# EAGLE design controllerboost (EAGLE 7.7.0)
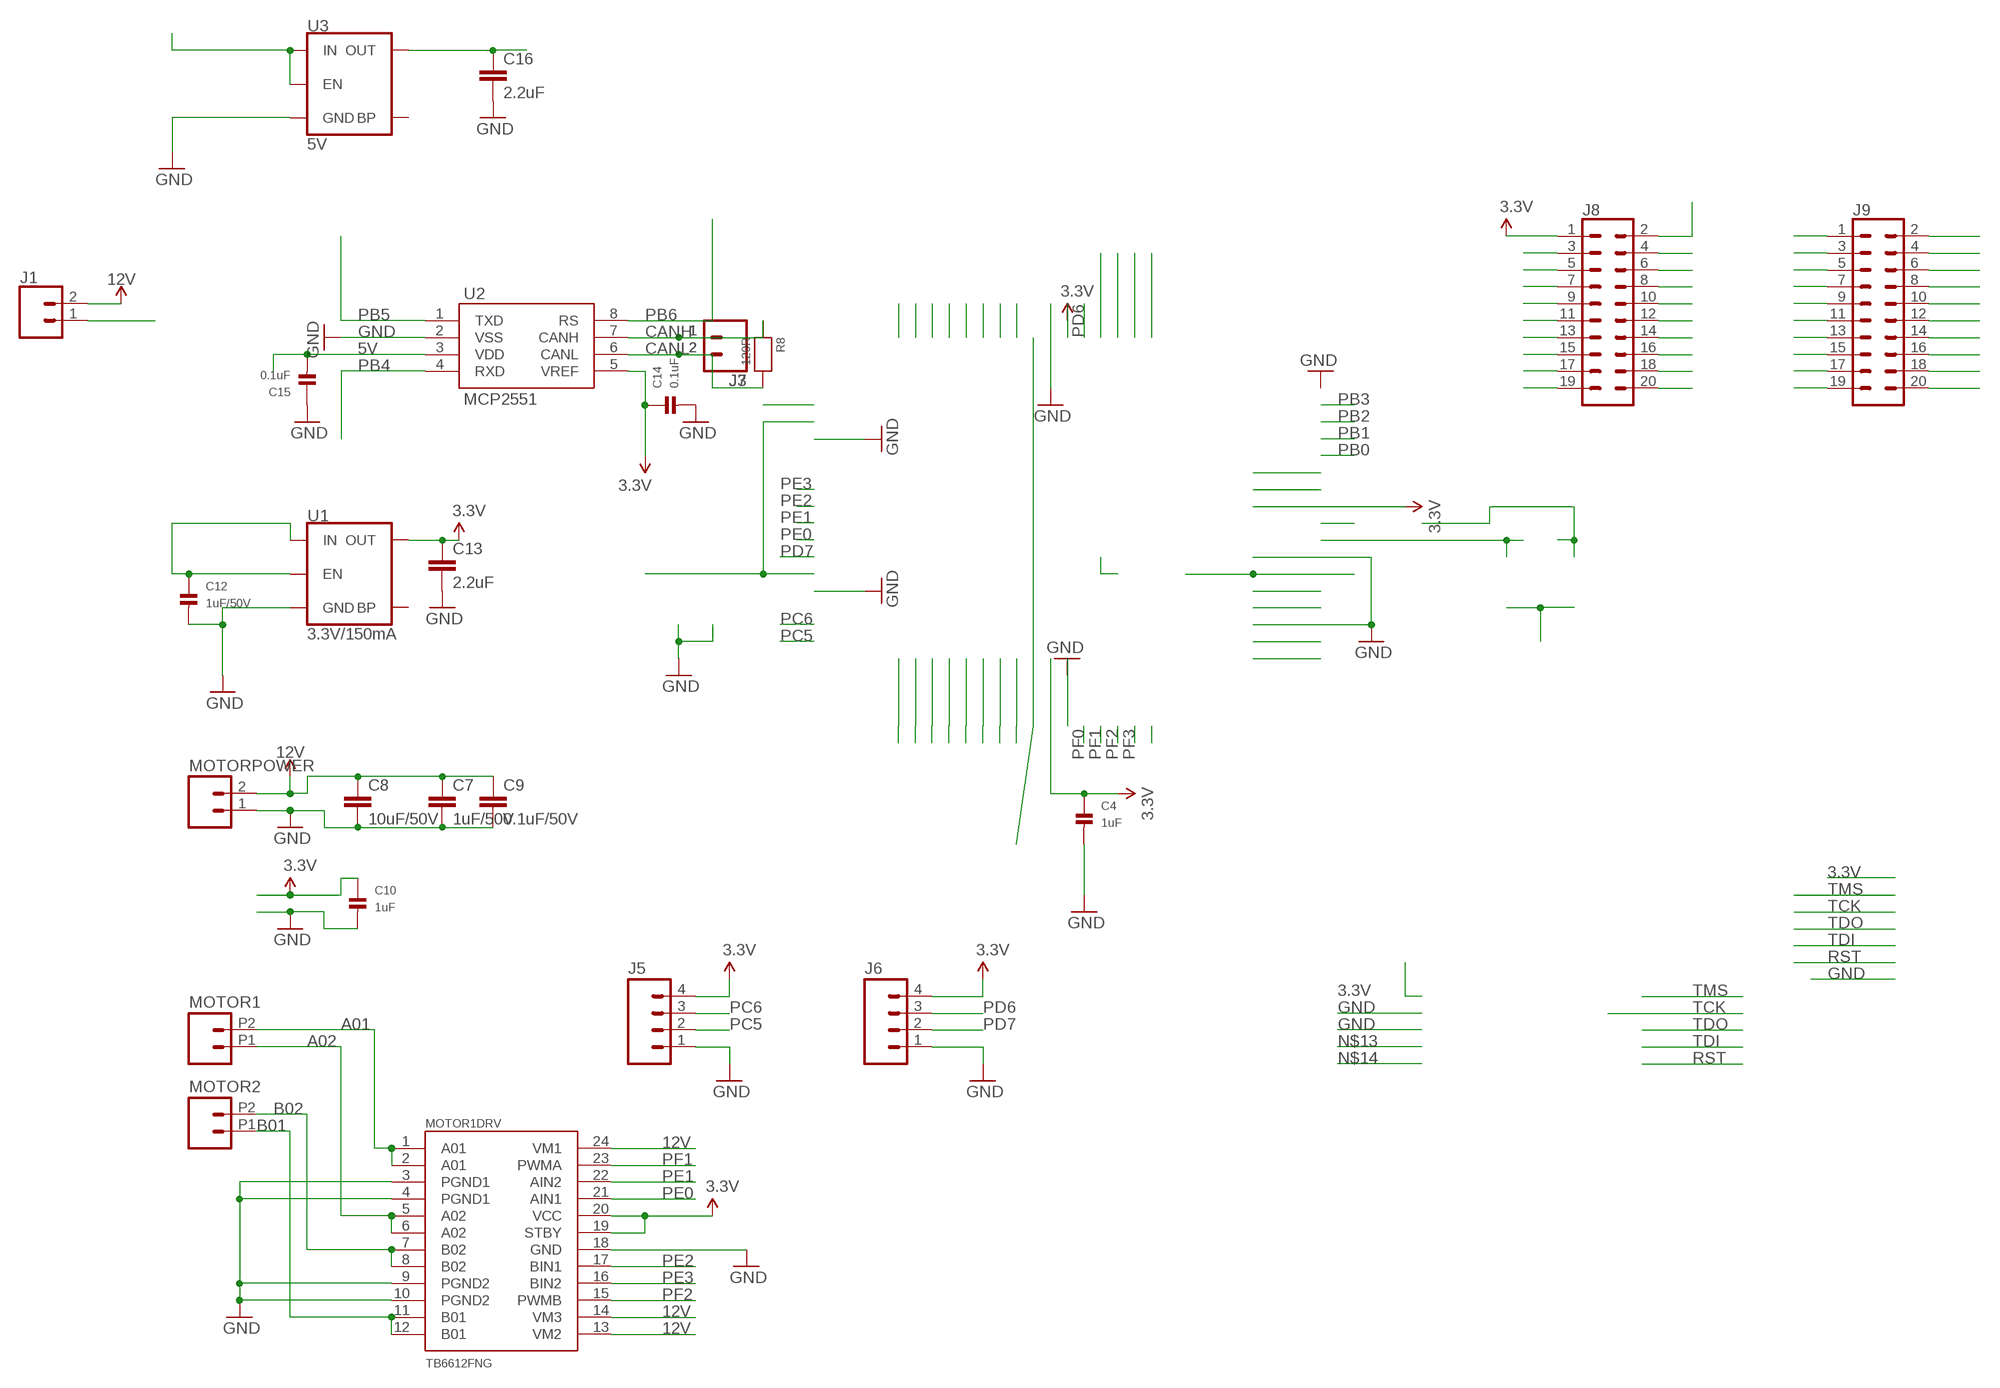
[diagram p0: schematic, sheet 1]

## Parts
C4  1uF  CAP_CERAMIC_0603MP  [_0603MP]
C7  1uF/50V  0.1UF-25V(+80/-20%)(0603)  [0603-CAP]
C8  10uF/50V  1.0UF-25V-+80/-20(0805)"  [0805-CAP]
C9  0.1uF/50V  0.1UF-25V(+80/-20%)(0603)  [0603-CAP]
C10  1uF  CAP_CERAMIC_0603MP  [_0603MP]
C12  1uF/50V  CAP_CERAMIC_0603MP  [_0603MP]
C13  2.2uF  2.2UF-0805-25V-(+80/-20%)  [0805]
C14  0.1uF  CAP_CERAMIC_0603MP  [_0603MP]
C15  0.1uF  CAP_CERAMIC_0603MP  [_0603MP]
C16  2.2uF  2.2UF-0805-25V-(+80/-20%)  [0805]
J1  CONN_02  [1X02]
J3  CONN_02  [1X02]
J5  M04PTH  [1X04]
J6  M04PTH  [1X04]
J7  CONN_02  [1X02]
J8  CONN_10X2  [2X10]
J9  CONN_10X2  [2X10]
MOTOR1  M022.54MM_SCREWTERM  [1X02_2.54_SCREWTERM@1]
MOTOR1DRV  TB6612FNG  [SSOP24]
MOTOR2  M022.54MM_SCREWTERM  [1X02_2.54_SCREWTERM@1]
MOTORPOWER  M02PTH  [1X02@1]
R8  120R  RESISTOR_0603MP  [_0603MP]
U1  3.3V/150mA  V_REG_MIC52053.3V  [SOT23-5]
U2  MCP2551  [SO08]
U3  5V  V_REG_MIC52053.3V  [SOT23-5]

## Nets
3.3V: C4.1 C10.1 C13.1 C14.1 J5.4 J6.4 J8.1 MOTOR1DRV.19(STBY) MOTOR1DRV.20(VCC) U1.5(OUT) U2.5(VREF)
5V: C15.2 C16.1 J8.2 U2.3(VDD) U3.5(OUT)
12V: C7.1 C8.1 C9.1 J1.2 MOTOR1DRV.13(VM2) MOTOR1DRV.14(VM3) MOTOR1DRV.24(VM1) MOTORPOWER.2
A01: MOTOR1.P2 MOTOR1DRV.1(A01) MOTOR1DRV.2(A01)
A02: MOTOR1.P1 MOTOR1DRV.5(A02) MOTOR1DRV.6(A02)
B01: MOTOR1DRV.11(B01) MOTOR1DRV.12(B01) MOTOR2.P1
B02: MOTOR1DRV.7(B02) MOTOR1DRV.8(B02) MOTOR2.P2
CANH: J3.1 J7.1 R8.1 U2.7(CANH)
CANL: J3.2 J7.2 R8.2 U2.6(CANL)
GND: C4.2 C7.2 C8.2 C9.2 C10.2 C12.2 C13.2 C14.2 C15.1 C16.2 J5.1 J6.1 J8.4 J9.2 MOTOR1DRV.3(PGND1) MOTOR1DRV.4(PGND1) MOTOR1DRV.9(PGND2) MOTOR1DRV.10(PGND2) MOTOR1DRV.18(GND) MOTORPOWER.1 U1.2(GND) U2.2(VSS) U3.2(GND)
P2L: C12.1 J1.1 U1.1(IN) U1.3(EN) U3.1(IN) U3.3(EN)
PA2: J9.20
PA3: J9.18
PA4: J9.16
PA5: J8.15
PA6: J8.17
PA7: J8.19
PB0: J8.5
PB1: J8.7
PB2: J9.4
PB3: J9.5
PB4: J8.13 U2.4(RXD)
PB5: J8.3 U2.1(TXD)
PB6: J9.14 U2.8(RS)
PB7: J9.12
PC4: J9.7
PC5: J5.2 J9.9
PC6: J5.3 J9.11
PC7: J9.13
PD0: J8.6
PD1: J8.8
PD2: J8.10
PD3: J8.12
PD6: J6.3 J9.15
PD7: J6.2 J9.17
PE0: J9.6 MOTOR1DRV.21(AIN1)
PE1: J8.14 MOTOR1DRV.22(AIN2)
PE2: J8.16 MOTOR1DRV.17(BIN1)
PE3: J8.18 MOTOR1DRV.16(BIN2)
PE4: J8.9
PE5: J8.11
PF0: J9.8
PF1: J8.20 MOTOR1DRV.23(PWMA)
PF2: J9.1 MOTOR1DRV.15(PWMB)
PF3: J9.3
PF4: J9.19
RST: J9.10
Unconnected: U1.4(BP) U3.4(BP)

## Library data of the parts
C4 C10 C12 C14 C15 = microbuilder:CAP_CERAMIC: Ceramic Capacitors 0402 - 0402 Surface Mount Capacitors 16pF 50V 5% [Digikey: 445-4899-2-ND] 18pF 50V 5% [Digikey: 490-1281-2-ND] 22pF 50V 5% [Digikey: 490-1283-2-ND] 68pF 50V 5% [Digikey: 490-1289-2-ND] 0.1uF 10V 10% [Digikey: 490-1318-2-ND] 1.0uF 6.3V 10% [Digikey: 490-1320-2-ND] 0603 - 0603 Surface Mount Capacitors 16 pF 50V 5% [Digikey: 445-5051-2-ND] 22 pF 50V [Digikey: PCC220ACVTR-ND] 33 pF 50V 5% [Digikey: 490-1415-1-ND] 56pF 50V 5% [Digikey: 490-1421-1-ND] 220pF 50V 5% [Digikey: 445-1285-1-ND] 680 pF 50V 2200 pF 50V 5% C0G [Digikey: 445-1297-1-ND] 5600 pF 100V 5% X7R [Digikey: 478-3711-1-ND] 0.1 µF 25V 10% [Digikey: PCC2277TR-ND] 0.22 µF 16V 10% X7R [Digikey: 445-1318-1-ND] 1.0 µF 25V 10% [Digikey: 445-5146-2-ND] 0603 - RF Specific 3pF 250V +/-0.1pF RF [Digikey: 712-1347-1-ND] 18 pF 250V 5% [Digikey: 478-3505-1-ND or 712-1322-1-ND] 56 pF 250V 5% C0G RF [Digikey: 490-4867-1-ND] 68 pF 250V RF [Digikey: 490-4868-1-ND] 0805 - 0805 Surface Mount Capacitors 220 pF 250V 2% RF Ceramic Capacitor [Digikey: 712-1398-1-ND] 1000 pF 50V 2% NP0 Ceramic Capacitor [Digikey: 478-3760-1-ND] 0.1 µF 25V 10% Ceramic Capacitor [Digikey: PCC1828TR-ND] 1.0 µF 16V 10% Ceramic Capacitor[Digikey: 490-1691-2-ND] 10.0 µF 10V 10% Ceramic Capacitor[Digikey: 709-1228-1-ND] 10.0 uF 16V 10% Ceramic Capacitor [Digikey: 478-5165-2-ND] 47 uF 6.3V 20% Ceramic Capacitor [Digikey: 587-1779-1-ND or 399-5506-1-ND] 1206 - 1206 Surface Mount Capacitors 47uF 10V 20% Ceramic Capacitor [Digikey: 490-5528-1-ND or 399-5508-1-ND or 445-6010-1-ND] 100uF 6.3V -20%, +80% Y5V Ceramic Capacitor (Digikey: 490-4512-1-ND, Mouser: 81-GRM31CF50J107ZE1L)
C7 C9 = SparkFun-Capacitors:0.1UF-25V(+80/-20%)(0603): CAP-00810 Ceramic Standard decoupling cap; PROD_ID: CAP-00810; VALUE: 0.1uF
C8 = SparkFun-Capacitors:1.0UF-25V-+80/-20(0805): CAP-11625; PROD_ID: CAP-11625; VALUE: 1.0uF
C13 C16 = SparkFun-Capacitors:2.2UF: 2.2µF ceramic capacitors A capacitor is a passive two-terminal electrical component used to store electrical energy temporarily in an electric field.; PROD_ID: CAP-11624
J1 J3 J7 = SparkFun-Connectors:CONN_02: Multi connection point. Often used as Generic Header-pin footprint for 0.1 inch spaced/style header connections On any of the 0.1 inch spaced packages, you can populate with these: Break Away Headers - Straight <https://www.sparkfun.com/products/116> (PRT-00116) Break Away Male Headers - Right Angle <https://www.sparkfun.com/products/553> (PRT-00553) Female Headers <https://www.sparkfun.com/products/115> (PRT-00115) Break Away Headers - Machine Pin <https://www.sparkfun.com/products/117> (PRT-00117) Break Away Female Headers - Swiss Machine Pin <https://www.sparkfun.com/products/743> (PRT-00743) For SCREWTERMINALS and SPRING TERMINALS visit here: Screw Terimnals on SparkFun.com <https://www.sparkfun.com/search/results?term=Screw+Terminals> (5mm/3.5mm/2.54mm spacing) This device is also useful as a general connection point to wire up your design to another part of your project. Our various solder wires solder well into these plated through hole pads. Hook-Up Wire - Assortment (Stranded, 22 AWG) <https://www.sparkfun.com/products/11375> (PRT-11375) Hook-Up Wire - Assortment (Solid Core, 22 AWG) <https://www.sparkfun.com/products/11367> (PRT-11367) View the entire wire category on our website here <https://www.sparkfun.com/categories/141> Special notes: Molex polarized connector foot print use with: PRT-08233 with associated crimp pins and housings. 2.54_SCREWTERM for use with PRT-10571. 3.5mm Screw Terminal footprints for PRT-08084 5mm Screw Terminal footprints for use with PRT-08432
J5 J6 = SparkFun-Connectors:M04: Header 4 Standard 4-pin 0.1" header. Use with straight break away headers (SKU : PRT-00116), right angle break away headers (PRT-00553), swiss pins (PRT-00743), machine pins (PRT-00117), and female headers (PRT-00115). Molex polarized connector foot print use with SKU : PRT-08231 with associated crimp pins and housings. 1MM SMD Version SKU: PRT-10208; PROD_ID: CONN-09696
J8 J9 = SparkFun-Connectors:CONN_10X2: Multi connection point. Often used as Generic Header-pin footprint for 0.1 inch spaced/style header connections On any of the 0.1 inch spaced packages, you can populate with these: Break Away Headers - Straight <https://www.sparkfun.com/products/116> (PRT-00116) Break Away Male Headers - Right Angle <https://www.sparkfun.com/products/553> (PRT-00553) Female Headers <https://www.sparkfun.com/products/115> (PRT-00115) Break Away Headers - Machine Pin <https://www.sparkfun.com/products/117> (PRT-00117) Break Away Female Headers - Swiss Machine Pin <https://www.sparkfun.com/products/743> (PRT-00743) Special note about the "SPECIAL" package: This was SPECIALLY designed to be used with our Graphic LCD Backpack. Be sure you want to use this! It is not only staggered on each line of header holes, but IT IS ALSO offset of the center point of the top and bottom lines by 5 mil. This causes the headers to lock into place on the "standard" footprint on the LCD screen. The extra squares on the tdocu layer are there simply to reference other pins (if you were to actually populate a longer header than ten long - this is what we do with the backpacks).
MOTOR1 MOTOR2 MOTORPOWER = SparkFun-Connectors:M02: Standard 2-pin 0.1" header. Use with - straight break away headers ( PRT-00116) - right angle break away headers (PRT-00553) - swiss pins (PRT-00743) - machine pins (PRT-00117) - female headers (PRT-00115) Molex polarized connector foot print use with: PRT-08233 with associated crimp pins and housings. 2.54_SCREWTERM for use with PRT-10571. 3.5mm Screw Terminal footprints for PRT-08084 5mm Screw Terminal footprints for use with PRT-08432
MOTOR1DRV = SparkFun-IC-Special-Function:TB6612FNG: Toshiba 1A dual motor driver IC-09363; PROD_ID: IC-09363
R8 = microbuilder:RESISTOR: Resistors 0402 - 0402 Surface Mount Package 22 Ohm 1% 1/16W [Digikey: 311-22.0LRTR-ND] 33 Ohm 5% 1/16W 1.0K 5% 1/16W 1.5K 5% 1/16W 2.0K 1% 1/16W 10.0K 1% 1/16W [Digikey: 311-10.0KLRTR-ND] 10.0K 5% 1/16W [Digikey: RMCF0402JT10K0TR-ND] 12.1K 1% 1/16W [Digikey: 311-22.0LRTR-ND] 100.0K 5% 1/16W 0603 - 0603 Surface Mount Package 0 Ohm 1/10 Watt 1% Resistor 15 Ohm 1/10 Watt 1% Resistor 33 Ohm 1/10 Watt 1% Resistor 49.9 Ohm 1/10 Watt 1% Resistor 100 Ohm 1/10 Watt 1% Resistor 150 Ohm 1/10 Watt 1% Resistor 240 Ohm 1/10 Watt 1% Resistor 390 Ohm 1/10 Watt 1% Resistor 560 Ohm 1/10 Watt 1% Resistor 680 Ohm 1/10 Watt 1% Resistor 750 Ohm 1/10 Watt 1% Resistor 1.0K Ohm 1/10 Watt 1% Resistor 1.5K Ohm 1/10 Watt 1% Resistor 2.0K Ohm 1/10 Watt 1% Resistor 2.2K Ohm 1/10 Watt 1% Resistor 3.3K Ohm 1/10 Watt 1% Resistor 4.7K Ohm 1/10 Watt 1% Resistor 10.0K Ohm 1/10 Watt 1% Resistor 12.0K Ohm 1/10 Watt 1% Resistor 12.1K Ohm 1/10 Watt 1% Resistor 20.0K Ohm 1/10 Watt 1% Resistor 33.0K Ohm 1/10 Watt 1% Resistor 100.0K Ohm 1/10 Watt 1% Resistor 0805 - 0805 Surface Mount Package 0 Ohm 1/8 Watt 1% Resistor 33 Ohm 1/8 Watt 1% Resistor 100 Ohm 1/8 Watt 1% Resistor 150 Ohm 1/8 Watt 1% Resistor 200 Ohm 1/8 Watt 1% Resistor 240 Ohm 1/8 Watt 1% Resistor 330 Ohm 1/8 Watt 1% Resistor 390 Ohm 1/8 Watt 1% Resistor 470 Ohm 1/8 Watt 1% Resistor 1.0K Ohm 1/8 Watt 1% Resistor 1.5K Ohm 1/8 Watt 1% Resistor 2.0K Ohm 1/8 Watt 1% Resistor 4.7K Ohm 1/8 Watt 1% Resistor 5.1K Ohm 1/8 Watt 1% Resistor 5.6K Ohm 1/8 Watt 1% Resistor 10.0K Ohm 1/8 Watt 1% Resistor 22.0K Ohm 1/8 Watt 1% Resistor 33.0K Ohm 1/8 Watt 1% Resistor 100K Ohm 1/8 Watt 1% Resistor 1206 - 1206 Surface Mount Package 2012 - 2010 Surface Mount Package 0.11 Ohm 1/2 Watt 1% Resistor - Digikey: RHM.11UCT-ND
U1 = SparkFun-IC-Power:V_REG_MIC5205: V_REG MIC5205 Standard 3.3V, 5V, and Adjustable 150mA LDO voltage regulator in SOT-23 layout. Micrel part MIC5205. BP (by-pass) pin is used to lower output noise with 470pF cap, may be left open. On the adjustable version BP is used to set output.; PROD_ID: VREG-00822
U2 = SparkFun-IC-Comms:MCP2551: MCP2551 High Speed CAN Transceiver High speed CAN transceiver Datasheet <http://www.sparkfun.com/datasheets/DevTools/Arduino/MCP2551.pdf> SparkFun Products CAN-BUS Shield <https://www.sparkfun.com/products/13262> (DEV-13262) SparkFun OBD-II UART <https://www.sparkfun.com/products/9555> (WIG-09555); PROD_ID: IC-09907
U3 = SparkFun-IC-Power:V_REG_MIC5205: V_REG MIC5205 Standard 3.3V, 5V, and Adjustable 150mA LDO voltage regulator in SOT-23 layout. Micrel part MIC5205. BP (by-pass) pin is used to lower output noise with 470pF cap, may be left open. On the adjustable version BP is used to set output.; PROD_ID: VREG-00822; VALUE: 3.3V/150mA

## Board
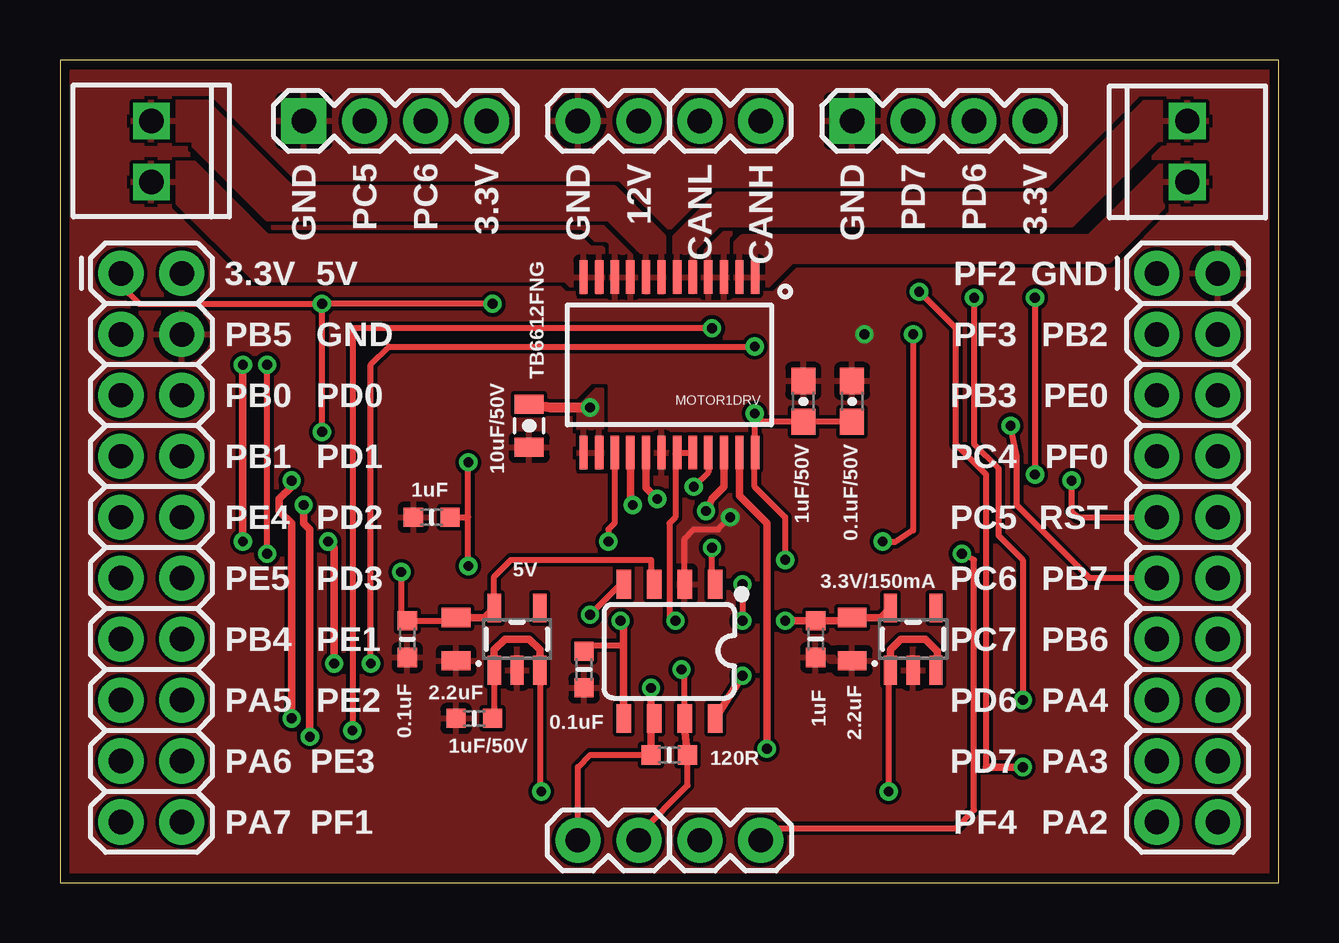
[diagram p1: board, top side]
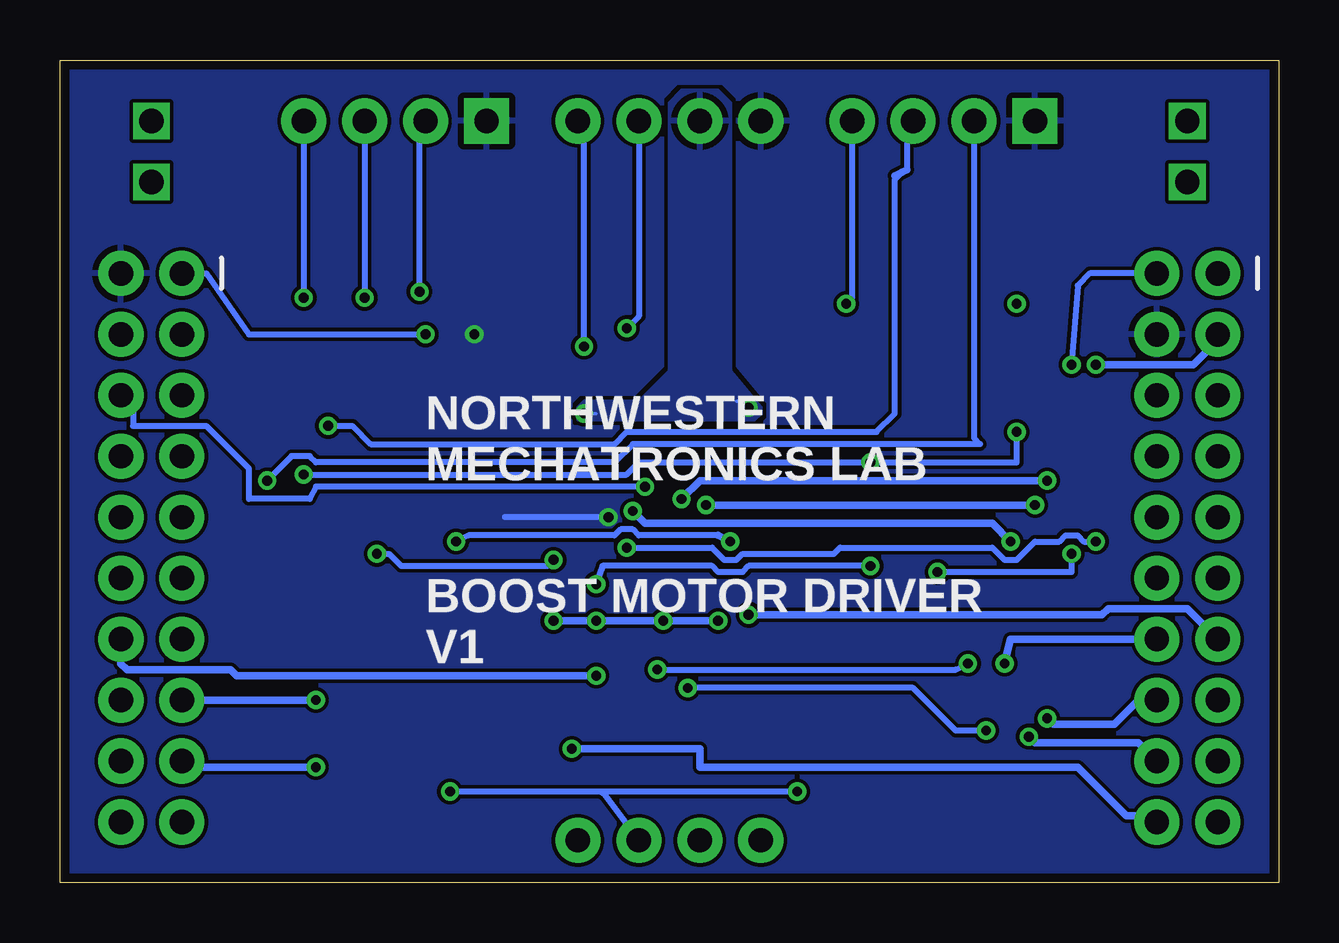
[diagram p2: board, bottom side, seen from below]

Size 50.8 x 34.29 mm. Coordinates in mm from the lower left corner, seen from the top.
Outline: 0,0 50.8,0 50.8,34.29 0,34.29 0,0
Copper layers (1*16): Top 0.0356mm / dielectric 1.5011mm / Bottom 0.0356mm
Design rules "LaenPCBOrder *": minimum track width 6mil, minimum drill 13mil, track to track 6mil, track to pad 6mil, pad to pad 6mil, via to via 6mil, smd to smd 6mil, copper to edge 15mil, drill to drill 6mil, minimum pad ring 7mil, minimum via ring 7mil, stop-mask expansion 3mil, vias tented up to drill 30mil, thermal gap 10mil

### Footprints (pad centres in the part's own frame; a part is rotated, then mirrored left to right if it is on the bottom)
_0603MP = smd 0.8 x 0.8: 1 -0.762,0; 2 0.762,0
0603-CAP = smd 1.1 x 1: 1 -0.85,0; 2 0.85,0
0805-CAP = smd 0.8 x 1.2: 1 -0.9,0; 2 0.9,0
0805 = smd 0.8 x 1.2: 1 -0.9,0; 2 0.9,0
1X02 = drill 1.016 pad 1.88: 1 0,0; 2 2.54,0
1X04 = drill 1.016 pad 1.88 square: 1 0,0 | drill 1.016 pad 1.88: 2 2.54,0; 3 5.08,0; 4 7.62,0
2X10 = drill 1.016 pad 1.88: 1 0,0; 2 0,2.54; 3 2.54,0; 4 2.54,2.54; 5 5.08,0; 6 5.08,2.54; 7 7.62,0; 8 7.62,2.54; 9 10.16,0; 10 10.16,2.54; 11 12.7,0; 12 12.7,2.54; 13 15.24,0; 14 15.24,2.54; 15 17.78,0; 16 17.78,2.54; 17 20.32,0; 18 20.32,2.54; 19 22.86,0; 20 22.86,2.54
1X02_2.54_SCREWTERM@1 = drill 1.016 square: P1 2.54,0; P2 0,0
SSOP24 = smd 0.348 x 1.397: 1 -3.575,-3.656; 2 -2.925,-3.656; 3 -2.275,-3.656; 4 -1.625,-3.656; 5 -0.975,-3.656; 6 -0.325,-3.656; 7 0.325,-3.656; 8 0.975,-3.656; 9 1.625,-3.656; 10 2.275,-3.656; 11 2.925,-3.656; 12 3.575,-3.656; 13 3.575,3.656; 14 2.925,3.656; 15 2.275,3.656; 16 1.625,3.656; 17 0.975,3.656; 18 0.325,3.656; 19 -0.325,3.656; 20 -0.975,3.656; 21 -1.625,3.656; 22 -2.275,3.656; 23 -2.925,3.656; 24 -3.575,3.656
1X02@1 = drill 1.016 pad 1.88: 1 0,0; 2 2.54,0
SOT23-5 = smd 0.55 x 1.2: 1 -0.95,-1.3; 2 0,-1.3; 3 0.95,-1.3; 4 0.95,1.3; 5 -0.95,1.3
SO08 = smd 0.6 x 1.2: 1 -1.905,-2.8; 2 -0.635,-2.8; 3 0.635,-2.8; 4 1.905,-2.8; 5 1.905,2.8; 6 0.635,2.8; 7 -0.635,2.8; 8 -1.905,2.8

### Placement (x,y rotation side)
C4  31.5,10.16 270 top
C7  30.99,20.07 90 top
C8  19.56,19.05 270 top
C9  33.02,20.07 90 top
C10  15.49,15.24 180 top
C12  17.27,6.86 180 top
C13  33.02,10.16 270 top
C14  21.84,8.89 270 top
C15  14.48,10.16 90 top
C16  16.51,10.16 270 top
J1  26.67,1.78 0 top
J3  24.13,1.78 180 top
J5  10.16,31.75 0 top
J6  33.02,31.75 0 top
J7  29.21,31.75 180 top
J8  2.54,25.4 270 top
J9  45.72,25.4 270 top
MOTOR1  46.99,29.21 90 top
MOTOR1DRV  25.4,21.59 180 top
MOTOR2  3.81,31.75 270 top
MOTORPOWER  21.59,31.75 0 top
R8  25.4,5.33 180 top
U1  35.56,10.16 0 top
U2  25.4,9.65 180 top
U3  19.05,10.16 0 top

### Tracks (layer width: path | path; a pad name or v marks a point on that pad's centre or on a via)
3.3V  (via drill 0.41)
  Top 0.254: J8.1 2.54,24.89 3.3,24.13 v10.92,24.13 | C14.1 22.1,9.91 23.5,9.91 | MOTOR1DRV.20 MOTOR1DRV.19 25.65,17.86 25.65,15.24 25.4,14.99 25.4,10.92 v25.65,10.92 | v40.64,24.38 v40.64,17.02 | v10.92,18.8 v10.92,24.13 | v17.02,13.21 17.02,15.24 | 17.02,15.24 v17.02,17.53 | v28.45,12.45 v28.45,10.92 | v18.03,24.13 v10.92,24.13 | C10.1 17.02,15.24
  Top 0.305: U1.5 34.21,11.06 C13.1 32.88,10.92 C4.1 v30.23,10.92 | U2.5 23.5,9.91 23.5,10.79 v23.37,10.92
  Bottom 0.254: J6.4 v40.64,24.38 | v40.64,17.02 27.18,17.02 26.67,17.53 v17.02,17.53 10.92,17.53 v10.92,18.8 | v17.02,13.21 22.1,13.21 22.35,12.95 23.37,12.95 23.62,13.21 28.19,13.21 v28.45,12.45 | J5.4 17.78,24.38 v18.03,24.13
  Bottom 0.305: v23.37,10.92 v25.65,10.92 v28.45,10.92 v30.23,10.92
5V  (via drill 0.41)
  Top 0.254: C16.1 16.37,10.92 C15.2 14.22,11.18 v14.22,12.95 | U3.5 18.1,12.77 18.8,13.46 24.64,13.46 24.64,12.58 U2.3 | v8.64,13.72 v8.64,21.59
  Top 0.305: C16.1 17.7,11.06 U3.5
  Bottom 0.254: J8.2 7.87,25.4 8.38,24.89 v8.64,21.59 | v8.64,13.72 8.64,12.95 v14.22,12.95
12V  (via drill 0.41)
  Top 0.152: MOTOR1DRV.24 28.96,17.95
  Top 0.254: v37.59,13.72 38.1,13.46 38.1,3.05 37.34,2.29 29.46,2.29 J1.2 | C9.1 C7.1 29.3,19.22 v28.96,19.56 28.98,19.54 MOTOR1DRV.24 28.96,17.91 28.96,16.51 30.23,15.24 v30.23,13.46
  Top 0.406: C8.1 20.46,19.81 v22.1,19.81
  Bottom 0.152: v28.96,19.56 28.45,19.56 | v22.1,19.81 22.35,20.07 22.61,20.07
  Bottom 0.254: v37.59,13.72 37.08,13.72 36.58,13.21 30.48,13.21 v30.23,13.46
  pour Bottom: 23.37,33.02 24.89,33.02 25.4,32.51 25.4,21.34 26.67,20.07 28.96,20.07 29.21,19.81 29.21,19.3 21.84,19.3 21.59,19.56 21.59,19.81 22.86,21.34 22.86,32.51
  pour Top: 21.59,17.53 21.59,19.81 21.84,20.07 22.35,20.57 22.61,20.57 22.61,17.27 21.59,17.27
A01
  pour Top: 28.19,24.64 28.19,26.67 28.45,26.92 42.93,26.92 45.97,29.97 47.75,29.97 47.75,28.45 46.23,28.45 43.69,25.91 30.48,25.91 29.21,24.64 28.45,24.64
A02
  pour Top: 25.65,24.64 25.65,26.92 27.43,28.7 41.4,28.7 45.21,32.51 47.75,32.51 47.75,30.99 45.72,30.99 42.16,27.43 27.43,27.43 26.42,26.42 26.42,24.64
B01
  pour Top (isolate 0.152): 3.3,28.45 4.83,28.45 8.13,25.15 21.08,25.15 21.59,24.64 22.61,24.64 22.61,26.42 22.1,26.42 21.59,26.92 8.64,26.92 5.59,29.97 3.05,29.97 3.05,28.45
B02
  pour Top (isolate 0.152): 3.05,30.99 5.59,30.99 5.59,30.73 8.64,27.69 22.86,27.69 24.13,26.42 24.38,26.16 24.38,24.64 25.15,24.64 25.15,26.92 23.11,28.96 9.65,28.96 6.1,32.51 3.05,32.51
CANH  (via drill 0.41)
  Top 0.254: U2.7 26.04,8.76 v25.91,8.89 | v12.95,9.14 12.95,21.59 13.72,22.35 v28.96,22.35 | J3.1 24.13,2.03 26.16,4.06 R8.1
  Top 0.305: U2.7 26.04,6.48 R8.1
  Bottom 0.254: v25.91,8.89 13.46,8.89 v12.95,9.14 | v28.96,22.35 28.96,31.5 J7.1
CANL  (via drill 0.41)
  Top 0.254: v27.18,23.11 12.19,23.11 v12.19,6.35 | v24.64,8.13 24.64,6.98 U2.6 | J3.2 21.59,4.83 22.1,5.33 R8.2
  Top 0.305: R8.2 v24.64,8.13
  Bottom 0.254: J7.2 26.67,23.62 v27.18,23.11 | v12.19,6.35 13.46,6.35 15.24,8.13 v24.64,8.13
GND  (via drill 0.41)
  Top 0.254: U2.2 26.04,14.35 26.42,14.73 27.43,14.73 v27.94,15.24
  Bottom 0.254: v27.94,15.24 32.26,15.24
  other vias: 33.53,22.86
  pour Bottom (rank 6): -1.27,36.83 52.32,36.83 52.32,-2.29 -1.27,-2.29
  pour Top (rank 6): 0,36.58 52.32,36.58 52.32,-2.29 -1.27,-2.29 -1.27,36.58
P2L  (via drill 0.41)
  Top 0.254: v34.54,3.81 34.54,8.79 U1.1 | U3.1 18.1,6.92 C12.1 | U3.3 20,3.88 v20.07,3.81
  Top 0.305: U3.1 18.1,9.72 18.54,10.16 19.56,10.16 20,9.72 U3.3 | U1.1 34.61,9.72 35.05,10.16 36.07,10.16 36.58,9.65 36.58,8.93 U1.3
  Bottom 0.254: J1.1 28.1,3.7 | 28.1,3.7 28.19,3.81 | 28.25,3.81 v34.54,3.81 | v20.07,3.81 28.19,3.81 | 28.19,3.81 28.25,3.81 | 28.25,3.81 28.1,3.7
PB4  (via drill 0.41)
  Top 0.254: U2.4 23.37,12.45 v22.1,11.18
  Bottom 0.305: J8.13 3.81,11.43 7.11,11.43 7.37,11.18 v22.1,11.18
PB5  (via drill 0.41)
  Top 0.254: U2.1 27.3,12.32 27.18,12.19 v27.18,13.97
  Top 0.305: v7.62,21.59 v7.62,14.22
  Bottom 0.254: v27.18,13.97 23.62,13.97 23.11,13.46 22.61,13.46 22.35,13.72 18.54,13.72 18.29,13.97 11.94,13.97 11.43,13.46 10.92,13.46 10.16,14.22 9.14,14.22 8.89,14.48 8.38,14.48 8.13,14.22 v7.62,14.22
  Bottom 0.305: J8.3 2.54,22.61 3.56,21.59 v7.62,21.59
PB6  (via drill 0.41)
  Top 0.305: U2.8 v28.44,8.63 v28.45,8.64
  Bottom 0.305: v28.45,8.64 43.43,8.64 43.69,8.89 48.01,8.89 48.26,9.14 J9.14
PC5  (via drill 0.41)
  Top 0.254: v42.16,16.76 42.16,15.49 42.42,15.24 J9.9
  Bottom 0.254: J5.2 12.7,18.54 12.45,18.29 26.92,18.29 27.69,17.53 40.13,17.53 40.39,17.78 41.15,17.78 v42.16,16.76
PC6  (via drill 0.41)
  Top 0.254: J9.11 42.93,12.7 39.88,15.75 39.88,17.78 v39.62,19.05
  Bottom 0.254: 15.49,29.72 15.49,31.5 J5.3 | v39.62,19.05 38.61,19.05 37.85,18.29 27.69,18.29 27.18,18.8 16.76,18.8 16,19.56 16,29.31 15.7,29.62
  Bottom 0.305: 16,29.46 15.7,29.62 15.49,29.72
PD6  (via drill 0.41)
  Top 0.254: v38.1,24.38 38.1,18.29 39.12,17.27 39.12,14.48 40.13,13.46 v40.13,7.62
  Bottom 0.254: J6.3 v38.1,24.38
  Bottom 0.305: v40.13,7.62 J9.15
PD7  (via drill 0.41)
  Top 0.254: 38.61,4.83 38.61,17.02 37.34,18.29 37.34,23.11 v35.81,24.64
  Top 0.305: v40.13,4.83 38.61,4.83
  Bottom 0.254: v35.81,24.64 35.81,31.5 J6.2 35.31,32
  Bottom 0.305: J9.17 45.47,4.83 v40.13,4.83
PE0  (via drill 0.41)
  Top 0.254: MOTOR1DRV.21 27.02,17.12 v26.42,16.51
  Bottom 0.254: J9.6 47.75,19.81 47.75,19.05 44.7,19.05 42.93,17.27 42.93,16 40.39,16 40.13,16.51 v26.42,16.51
PE1  (via drill 0.41)
  Top 0.305: MOTOR1DRV.22 27.69,17.92 27.69,16.51 27.18,16 v26.92,15.49 | v11.18,14.22 11.43,13.97 v11.43,9.14
  Bottom 0.305: v26.92,15.49 26.42,14.99 11.94,14.99 v11.18,14.22 | v11.43,9.14 11.18,10.16 J8.14
PE2  (via drill 0.41)
  Top 0.305: v9.65,6.86 9.65,14.99 9.14,15.49 9.14,16 9.65,16.51 v9.65,16.76 | v24.89,16 24.43,16.47 MOTOR1DRV.17
  Bottom 0.305: J8.16 5.84,7.62 6.86,6.6 9.4,6.6 v9.65,6.86 | v9.65,16.76 24.13,16.76 v24.89,16
PE3  (via drill 0.41)
  Top 0.305: MOTOR1DRV.16 23.77,15.85 v23.88,15.75 | v10.16,15.75 10.16,14.99 10.41,14.73 v10.41,6.1
  Bottom 0.305: v23.88,15.75 v10.16,15.75 | v10.41,6.1 10.16,5.84 5.84,5.84 J8.18
PF1  (via drill 0.41)
  Top 0.305: MOTOR1DRV.23 28.32,16.12 29.46,14.99 v29.46,5.59
  Bottom 0.305: v29.46,5.59 24.13,5.59 24.13,4.83 8.38,4.83 6.35,2.79 5.33,2.79 J8.20
PF2  (via drill 0.41)
  Top 0.254: MOTOR1DRV.15 23.11,14.99 22.86,14.73 v22.86,14.22 | v35.56,22.86 35.56,14.7 34.83,14.22 v34.29,14.22
  Bottom 0.254: v22.86,14.22 23.38,14.49 | 23.38,14.49 23.37,14.49 | J9.1 44.7,25.4 42.93,22.86 v35.56,22.86 | 23.38,14.49 26.68,14.49 26.92,14.73 27.43,14.73 27.69,14.48 33.77,14.49 v34.29,14.22
  Bottom 0.305: 23.37,14.49 v22.86,14.22

### Text on the board
tPlace: GND | PC5 | PC6 | 3.3V | GND | 12V | CANL | CANH | GND | PD7 | PD6 | 3.3V | PF2 | GND | 3.3V | 5V | PF3 | PB2 | PB5 | GND | PB3 | PE0 | PB0 | PD0 | PC4 | PF0 | PB1 | PD1 | PC5 | RST | PE4 | PD2 | PC6 | PB7 | PE5 | PD3 | PC7 | PB6 | PB4 | PE1 | PD6 | PA4 | PA5 | PE2 | PD7 | PA3 | PA6 | PE3 | PF4 | PA2 | PA7 | PF1
bPlace: NORTHWESTERN / MECHATRONICS LAB | BOOST MOTOR DRIVER / V1